# EAGLE design visp-i2c-mux-bmp388 (EAGLE 7.6.0)
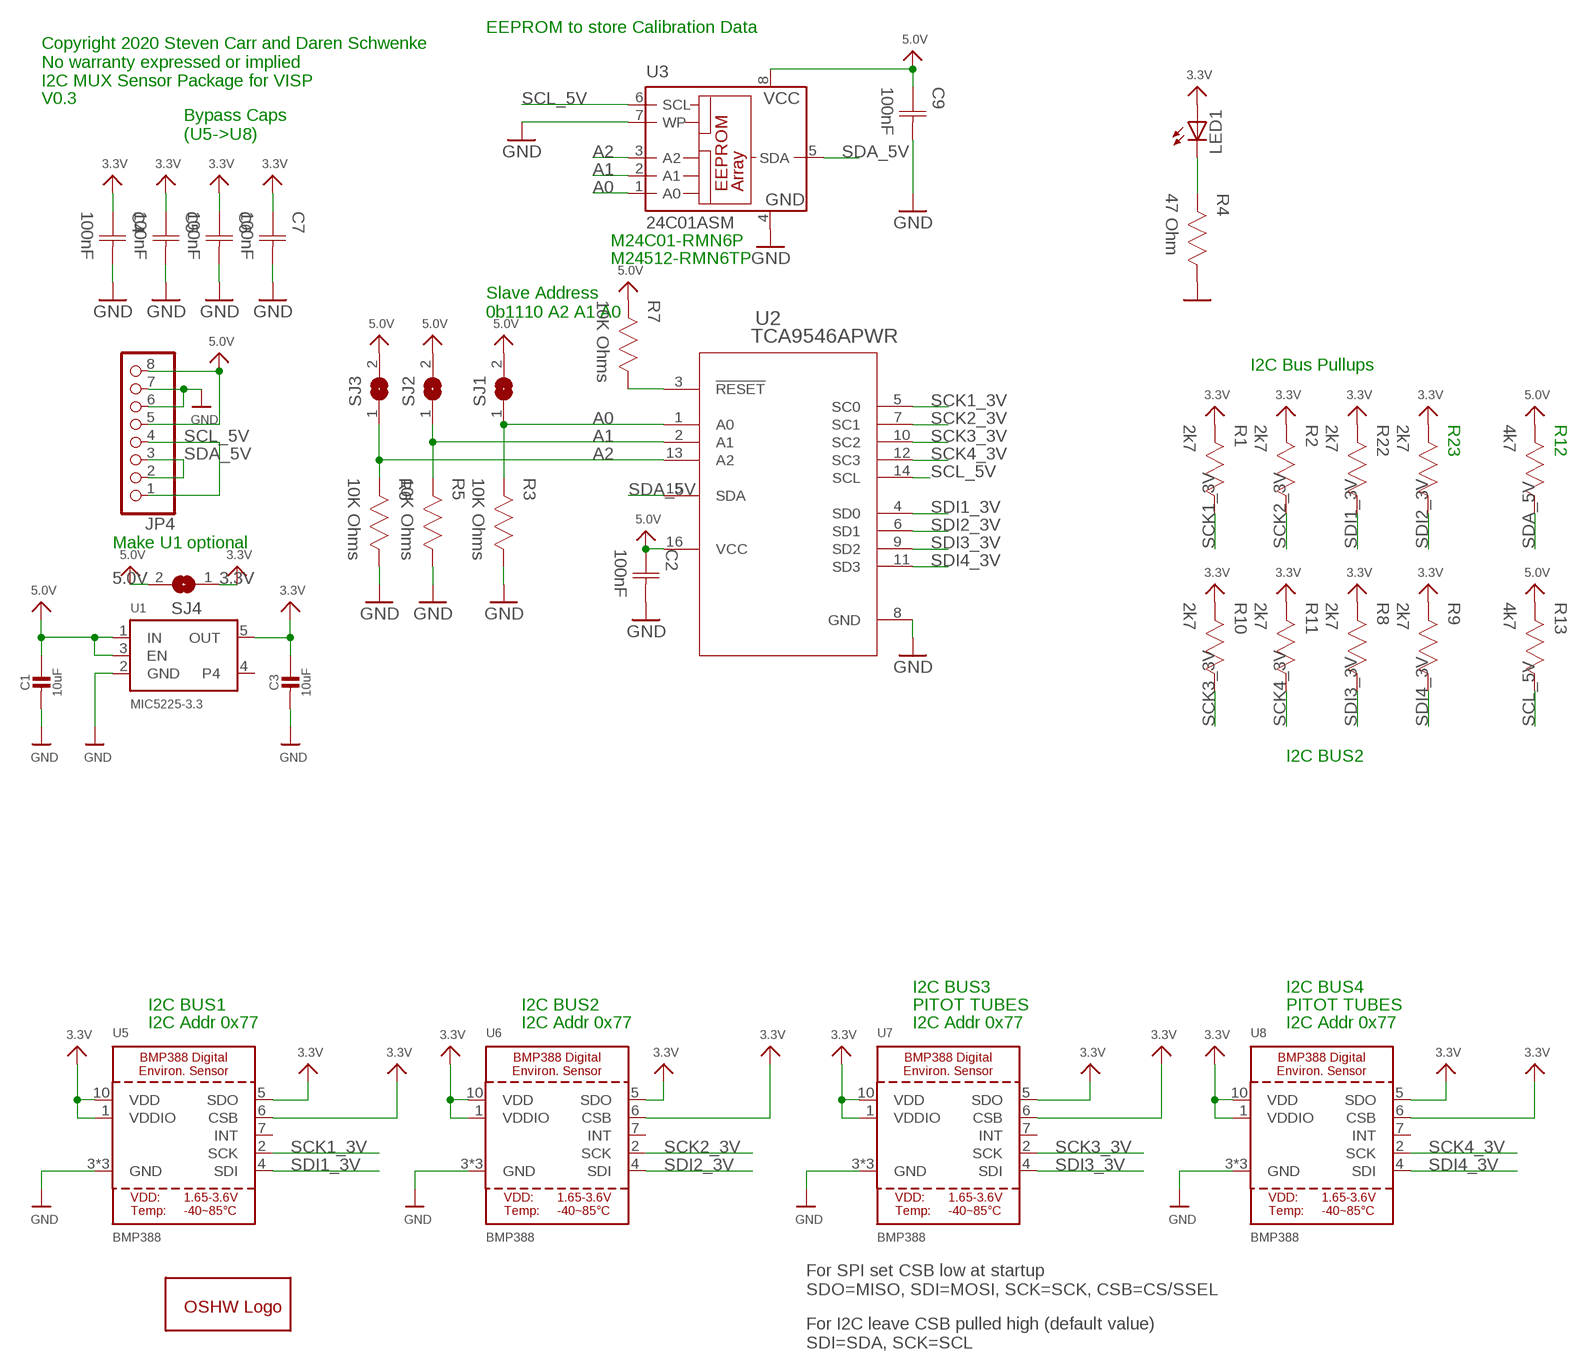
[diagram p0: schematic, sheet 1]

## Parts
C1  10uF  CAP_CERAMIC_0805  [_0805]
C2  100nF  CAPACITOR-0402  [CAP0402]
C3  10uF  CAP_CERAMIC_0805  [_0805]
C4  100nF  CAPACITOR-0402  [CAP0402]
C5  100nF  CAPACITOR-0402  [CAP0402]
C6  100nF  CAPACITOR-0402  [CAP0402]
C7  100nF  CAPACITOR-0402  [CAP0402]
C9  100nF  CAPACITOR-0402  [CAP0402]
GOLD_ORB_SM1  OSHWLOGOLOGO8MM  [OSHW_8MM]
JP4  PINHD-1X08_2.54  [1X08]
LED1  LEDCHIP-LED0603  [CHIP-LED0603]
R1  2k7  RESISTOR-0402  [RES0402]
R2  2k7  RESISTOR-0402  [RES0402]
R3  10K Ohms  RESISTOR-0402  [RES0402]
R4  47 Ohm  RESISTOR-0402  [RES0402]
R5  10K Ohms  RESISTOR-0402  [RES0402]
R6  10K Ohms  RESISTOR-0402  [RES0402]
R7  10K Ohms  RESISTOR-0402  [RES0402]
R8  2k7  RESISTOR-0402  [RES0402]
R9  2k7  RESISTOR-0402  [RES0402]
R10  2k7  RESISTOR-0402  [RES0402]
R11  2k7  RESISTOR-0402  [RES0402]
R12  4k7  RESISTOR-0402  [RES0402]
R13  4k7  RESISTOR-0402  [RES0402]
R22  2k7  RESISTOR-0402  [RES0402]
R23  2k7  RESISTOR-0402  [RES0402]
SJ1  SJ  [SJ]
SJ2  SJ  [SJ]
SJ3  SJ  [SJ]
SJ4  SJ  [SJ]
U1  MIC5225-3.3  VREG_SOT23-5  [SOT23-5]
U2  TCA9546APWR  [PW16]
U3  24C01ASM  [SO-08M]
U5  BMP388  [BMP388]
U6  BMP388  [BMP388]
U7  BMP388  [BMP388]
U8  BMP388  [BMP388]

## Nets
3.3V: C3.1 C4.1(C1) C5.1(C1) C6.1(C1) C7.1(C1) LED1.A R1.2 R2.2 R8.2 R9.2 R10.2 R11.2 R22.2 R23.2 SJ4.1 U1.5(OUT) U5.1(VDDIO) U5.5(SDO) U5.6(CSB) U5.10(VDD) U6.1(VDDIO) U6.5(SDO) U6.6(CSB) U6.10(VDD) U7.1(VDDIO) U7.5(SDO) U7.6(CSB) U7.10(VDD) U8.1(VDDIO) U8.5(SDO) U8.6(CSB) U8.10(VDD)
5.0V: C1.1 C2.1(C1) C9.1(C1) JP4.5 JP4.8 R7.2 R12.2 R13.2 SJ1.2 SJ2.2 SJ3.2 SJ4.2 U1.1(IN) U1.3(EN) U2.16(VCC) U3.8(VCC)
A0: R3.2 SJ1.1 U2.1(A0) U3.1(A0)
A1: R5.2 SJ2.1 U2.2(A1) U3.2(A1)
A2: R6.2 SJ3.1 U2.13(A2) U3.3(A2)
GND: C1.2 C2.2(C2) C3.2 C4.2(C2) C5.2(C2) C6.2(C2) C7.2(C2) C9.2(C2) JP4.6 JP4.7 R3.1 R4.1 R5.1 R6.1 U1.2(GND) U2.8(GND) U3.4(GND) U3.7(WP) U5.3(GND) U5.8(GND) U5.9(GND) U6.3(GND) U6.8(GND) U6.9(GND) U7.3(GND) U7.8(GND) U7.9(GND) U8.3(GND) U8.8(GND) U8.9(GND)
LED: LED1.C R4.2
RESET: R7.1 U2.3(!RESET)
SCK1_3V: R1.1 U2.5(SC0) U5.2(SCK)
SCK2_3V: R2.1 U2.7(SC1) U6.2(SCK)
SCK3_3V: R10.1 U2.10(SC2) U7.2(SCK)
SCK4_3V: R11.1 U2.12(SC3) U8.2(SCK)
SCL_5V: JP4.1 JP4.4 R13.1 U2.14(SCL) U3.6(SCL)
SDA_5V: JP4.2 JP4.3 R12.1 U2.15(SDA) U3.5(SDA)
SDI1_3V: R22.1 U2.4(SD0) U5.4(SDI)
SDI2_3V: R23.1 U2.6(SD1) U6.4(SDI)
SDI3_3V: R8.1 U2.9(SD2) U7.4(SDI)
SDI4_3V: R9.1 U2.11(SD3) U8.4(SDI)
Unconnected: U1.4 U5.7(INT) U6.7(INT) U7.7(INT) U8.7(INT)

## Notes on the sheet
- EEPROM to store Calibration Data
- Copyright 2020 Steven Carr and Daren Schwenke
  No warranty expressed or implied
  I2C MUX Sensor Package for VISP
- V0.3
- Bypass Caps
  (U5->U8)
- M24C01-RMN6P
- M24512-RMN6TP
- Slave Address
  0b1110 A2 A1 A0
- I2C Bus Pullups
- Make U1 optional
- I2C BUS2
- I2C BUS3 | I2C BUS4
- I2C BUS1 | I2C BUS2 | PITOT TUBES | PITOT TUBES
- I2C Addr 0x77 | I2C Addr 0x77 | I2C Addr 0x77 | I2C Addr 0x77
- For SPI set CSB low at startup
  SDO=MISO, SDI=MOSI, SCK=SCK, CSB=CS/SSEL
- For I2C leave CSB pulled high (default value)
  SDI=SDA, SCK=SCL

## Library data of the parts
C1 C3 = microbuilder:CAP_CERAMIC: Ceramic Capacitors For new designs, use the packages preceded by an '_' character since they are more reliable: The following footprints should be used on most boards: _0402 - Standard footprint for regular board layouts _0603 - Standard footprint for regular board layouts _0805 - Standard footprint for regular board layouts _1206 - Standard footprint for regular board layouts For extremely tight-pitch boards where space is at a premium, the following 'micro-pitch' footprints can be used (smaller pads, no silkscreen outline, etc.): _0402MP - Micro-pitch footprint for very dense/compact boards _0603MP - Micro-pitch footprint for very dense/compact boards _0805MP - Micro-pitch footprint for very dense/compact boards _1206MP - Micro-pitch footprint for very dense/compact boards; MPN: C1608X5R1A106M080AC
C2 C9 = Capacitor:CAPACITOR; MPN: CL10B104KB8NNNC
C4-C7 = Capacitor:CAPACITOR; MPN: CL10F104ZO8NNNC
GOLD_ORB_SM1 = oshw:OSHWLOGO: The OSHW logo for PCB layout
JP4 = pinhead-2:PINHD-1X08: PIN HEADER
LED1 = led:LED: LED OSRAM: - CHIPLED LG R971, LG N971, LY N971, LG Q971, LY Q971, LO R971, LY R971 LH N974, LH R974 LS Q976, LO Q976, LY Q976 LO Q996 - Hyper CHIPLED LW Q18S LB Q993, LB Q99A, LB R99A - SideLED LS A670, LO A670, LY A670, LG A670, LP A670 LB A673, LV A673, LT A673, LW A673 LH A674 LY A675 LS A676, LA A676, LO A676, LY A676, LW A676 LS A679, LY A679, LG A679 - Hyper Micro SIDELED® LS Y876, LA Y876, LO Y876, LY Y876 LT Y87S - SmartLED LW L88C, LW L88S LB L89C, LB L89S, LG L890 LS L89K, LO L89K, LY L89K LS L896, LA L896, LO L896, LY L896 - TOPLED LS T670, LO T670, LY T670, LG T670, LP T670 LSG T670, LSP T670, LSY T670, LOP T670, LYG T670 LG T671, LOG T671, LSG T671 LB T673, LV T673, LT T673, LW T673 LH T674 LS T676, LA T676, LO T676, LY T676, LB T676, LH T676, LSB T676, LW T676 LB T67C, LV T67C, LT T67C, LS T67K, LO T67K, LY T67K, LW E67C LS E67B, LA E67B, LO E67B, LY E67B, LB E67C, LV E67C, LT E67C LW T67C LS T679, LY T679, LG T679 LS T770, LO T770, LY T770, LG T770, LP T770 LB T773, LV T773, LT T773, LW T773 LH T774 LS E675, LA E675, LY E675, LS T675 LS T776, LA T776, LO T776, LY T776, LB T776 LHGB T686 LT T68C, LB T68C - Hyper Mini TOPLED® LB M676 - Mini TOPLED Santana® LG M470 LS M47K, LO M47K, LY M47K Source: http://www.osram.convergy.de LUXEON: - LUMILED® LXK2-PW12-R00, LXK2-PW12-S00, LXK2-PW14-U00, LXK2-PW14-V00 LXK2-PM12-R00, LXK2-PM12-S00, LXK2-PM14-U00 LXK2-PE12-Q00, LXK2-PE12-R00, LXK2-PE12-S00, LXK2-PE14-T00, LXK2-PE14-U00 LXK2-PB12-K00, LXK2-PB12-L00, LXK2-PB12-M00, LXK2-PB14-N00, LXK2-PB14-P00, LXK2-PB14-Q00 LXK2-PR12-L00, LXK2-PR12-M00, LXK2-PR14-Q00, LXK2-PR14-R00 LXK2-PD12-Q00, LXK2-PD12-R00, LXK2-PD12-S00 LXK2-PH12-R00, LXK2-PH12-S00 LXK2-PL12-P00, LXK2-PL12-Q00, LXK2-PL12-R00 Source: www.luxeon.com KINGBRIGHT: KA-3528ASYC Source: www.kingbright.com; MPN: SML-D12P8WT86
R1-R3 R5-R13 R22 R23 = Resistor:RESISTOR; MPN: CRCW060310K0FKEAC
R4 = Resistor:RESISTOR; MPN: RC0603FR-0747RL
SJ1-SJ4 = jumper:SJ: SMD solder JUMPER
U1 = microbuilder:VREG_SOT23-5: SOT23-5 Fixed Voltage Regulators Part Current Out V Out V In V Dropout θJA (°C/W) TJ (°C) Digikey Part No. ADP121 150mA 3.3V 3.4-5.5V 0.09V @ 150mA -- -- ADP121-AUJZ33R7CT-ND ADP121 150mA 3.0V 3.1-5.5V 0.09V @ 150mA -- -- ADP121-AUJZ30R7CT-ND ADP122 300mA 3.3V 3.4-5.5V 0.085V @ 300mA -- -- ADP122AUJZ-3.3-R7CT-ND ADP1712 300mA 3.3V 3.5-5.5V 0.17V @ 300mA -- -- ADP1712AUJZ-3.3-R7TR-ND AP7311 (Low Cost) 150mA 3.3V 3.5-6V 0.15V @ 150mA -- -- AP7311-33WG-7DICT-ND LD39015M18R 150mA 1.8V 1.9V-5.5V 0.08V @ 100mA -- -- 497-6977-1-ND LP2985A-33DBVR 150mA 3.3V 3.3-16V 0.28V @ 150mA 206 150 296-18479-1-ND MCP1824T-3302E/OT 300mA 3.3V 3.5V-6V 0.2V @ 300mA -- -- MCP1824T-3302E/OTCT-ND MIC5205-2.5YM5 TR 150mA 2.5V 2.7-16V 0.165V @ 150mA -- -- 576-1257-2-ND MIC5205-3.0YM5 TR 150mA 3.0V 3.2V-16V 0.165V @ 150mA -- -- 576-1258-2-ND MIC5205-3.3YM5 TR 150mA 3.3V 3.5V-16V 0.165V @ 150mA -- -- 576-1259-2-ND TPS780330220 150mA 3.3V+2.2V 3.6-5.5V 250mV Max -- -- 296-23332-1-ND TDA3663/N1,135 100mA 3.3V 3.5-45V 0.18V @ 50mA -- -- 568-5343-1-ND Max operating temp can be calculated using θJA, TJ (max junction temperature), and power in watts. Set the "Maximum Ambient Temperature" until it reaches TJ ("Max Junction Temperature"), which is the absolute limit for safe use of the regulator: Heat Sink Temperature Calculator <http://www.daycounter.com/Calculators/Heat-Sink-Temperature-Calculator.phtml> For example, With 12V source into a 3.3V LP2985 and a 30mA load, we are dissipating (12V-3.3V) * 0.03A = 0.261W. With a θJA of 206 °C/W, a TJ of 150°C, and 261mW we can safely use the chip without a heat sink up to 75°C (=147.1°C Junction Temperature).; MPN: MIC5225-3.3YM5-TR
U2 = TCA9546A:TCA9546APWR; BUILT_BY: EMA_UL_Team; MANUFACTURER_PART_NUMBER: TCA9546APWR; VENDOR: Texas Instruments
U3 = microchip:24*: Serial EEPROM I2C; MF: MICROCHIP; MPN: M24C01-RMN6P
U5-U8 = microbuilder:BMP388; MPN: BMP388

## Board
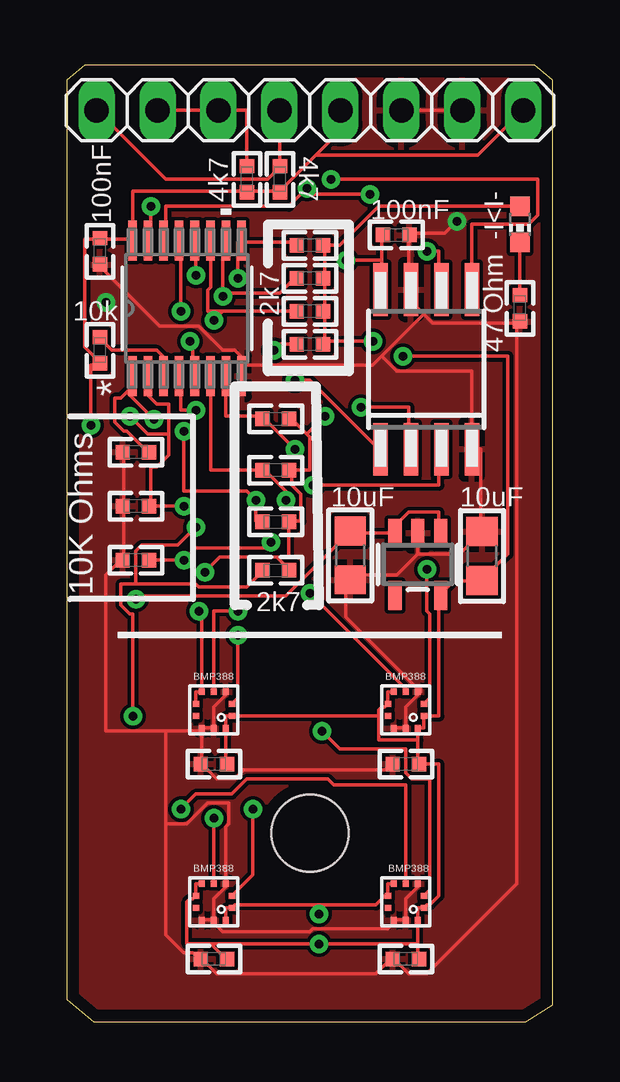
[diagram p1: board, top side]
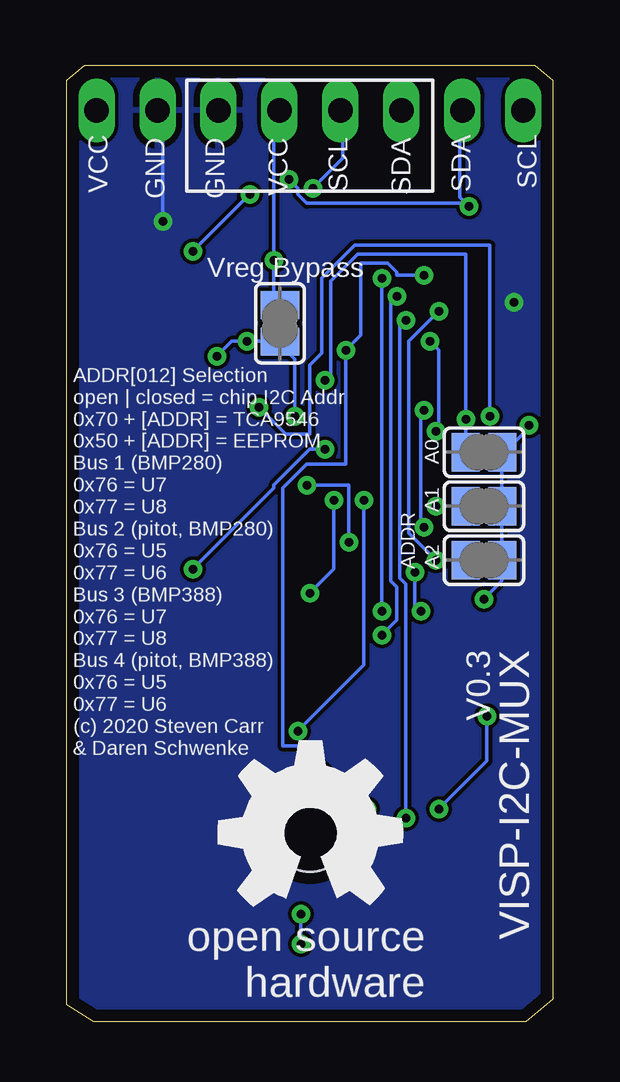
[diagram p2: board, bottom side, seen from below]

Size 20.25 x 39.88 mm. Coordinates in mm from the lower left corner, seen from the top.
Outline: 0.75,39.88 0,39.25 0,0.95 1.12,0 19.12,0 20.25,0.72 20.25,39.25 19.5,39.88 0.75,39.88
Copper layers (1*16): Top 0.0178mm / dielectric 59mil / Bottom 0.0178mm
Design rules "SSC-EAGLE-2Lyr_v1.0.0.3 *": minimum track width 6mil, minimum drill 14mil, track to track 6mil, track to pad 6mil, pad to pad 6mil, via to via 6mil, smd to smd 6mil, copper to edge 20mil, drill to drill 16mil, minimum pad ring 8mil, minimum via ring 8mil, stop-mask expansion 3mil, vias tented up to drill 0mil, thermal gap 10mil
Holes 3.2 mm at 10.12,7.88
vRestrict: area 4.6,2.5 to 7.6,5.5; area 12.6,2.5 to 15.6,5.5; area 4.6,10.5 to 7.6,13.5; area 12.6,10.5 to 15.6,13.5

### Footprints (pad centres in the part's own frame; a part is rotated, then mirrored left to right if it is on the bottom)
_0805 = smd 1.2 x 1.3: 1 -1.016,0; 2 1.016,0
CAP0402 = smd 0.6 x 0.6: 1 -0.55,0; 2 0.55,0
1X08 = drill 1.016 long: 1 -8.89,0; 2 -6.35,0; 3 -3.81,0; 4 -1.27,0; 5 1.27,0; 6 3.81,0; 7 6.35,0; 8 8.89,0
CHIP-LED0603 = smd 0.8 x 0.8: A 0,-0.75; C 0,0.75
RES0402 = smd 0.6 x 0.6: 1 -0.55,0; 2 0.55,0
SJ = smd 1.168 x 1.6: 1 -0.762,0; 2 0.762,0
SOT23-5 = smd 0.55 x 1.2: 1 -0.95,-1.3; 2 0,-1.3; 3 0.95,-1.3; 4 0.95,1.3; 5 -0.95,1.3
PW16 = smd 1.676 x 0.356: 1 -2.819,2.275; 2 -2.819,1.625; 3 -2.819,0.975; 4 -2.819,0.325; 5 -2.819,-0.325; 6 -2.819,-0.975; 7 -2.819,-1.625; 8 -2.819,-2.275; 9 2.819,-2.275; 10 2.819,-1.625; 11 2.819,-0.975; 12 2.819,-0.325; 13 2.819,0.325; 14 2.819,0.975; 15 2.819,1.625; 16 2.819,2.275
SO-08M = smd 0.6 x 2.2: 1 -1.905,-3.33; 2 -0.635,-3.33; 3 0.635,-3.33; 4 1.905,-3.33; 5 1.905,3.33; 6 0.635,3.33; 7 -0.635,3.33; 8 -1.905,3.33
BMP388 = smd 0.25 x 0.275: 1 0.25,0.75; 2 -0.25,0.75; 6 -0.25,-0.75; 7 0.25,-0.75 | smd 0.275 x 0.25: 3 -0.762,0.5; 4 -0.762,0; 5 -0.762,-0.5; 8 0.762,-0.5; 9 0.762,0; 10 0.762,0.5

### Placement (x,y rotation side)
C1  11.8,19.45 270 top
C2  1.38,32.12 270 top
C3  17.3,19.43 90 top
C4  6.12,10.75 180 top
C5  14.12,2.62 180 top
C6  6.12,2.62 180 top
C7  14.12,10.75 180 top
C9  13.72,32.8 0 top
GOLD_ORB_SM1  10.12,7.88 0 bottom
JP4  10.12,38 0 top
LED1  18.88,33.25 180 top
R1  8.71,20.84 0 top
R2  8.71,25.14 0 top
R3  2.88,23.75 0 top
R4  18.88,29.75 90 top
R5  2.88,21.5 0 top
R6  2.88,19.25 0 top
R7  1.38,28 270 top
R8  10.12,32.38 0 top
R9  10.12,29.62 0 top
R10  10.12,31 0 top
R11  10.12,28.25 0 top
R12  7.5,35.12 270 top
R13  8.88,35.12 270 top
R22  8.71,18.83 0 top
R23  8.71,23 0 top
SJ1  2.88,23.75 0 bottom
SJ2  2.88,21.5 0 bottom
SJ3  2.88,19.25 0 bottom
SJ4  11.38,29.12 90 bottom
U1  14.62,19.07 180 top
U2  5,29.75 90 top
U3  14.97,27.2 0 top
U5  14.12,5 270 top
U6  14.12,13 270 top
U7  6.12,13 270 top
U8  6.12,5 270 top

### Tracks (layer width: path | path; a pad name or v marks a point on that pad's centre or on a via)
3.3V  (via drill 0.36)
  Top 0.152: U8.10 6.62,4.75 U8.1 7,4.88 10.5,4.88 | U5.5 13.38,5.75 U5.6 13.25,5.25 12.88,4.88 10.5,4.88 | 14.62,3.25 14.62,2.62 C5.1 | 14.62,3.25 U5.10 14.62,4.75 U5.1 15,4.88 15.12,4.88 15.5,5.25 15.5,10.75 C7.1 14.62,10.75 14.62,11.75 | U8.5 5.38,5.75 U8.6 5.25,5.12 5.12,5.12 5,5 5,3.25 6,3.25 | 6,3.25 6.62,2.62 C6.1 | 6,3.25 v10.5,3.25 14.62,3.25 | v10.5,4.5 10.5,4.88 | C4.1 6.62,10.75 U7.10 6.62,12.75 U7.1 13,12.75 | U6.5 13.38,13.75 U6.6 13.25,13.12 13.12,13.12 13,13 13,12.75 | 14.62,11.75 U6.10 14.88,12.25 U6.1 15.5,12.75 15.5,17.75 U1.5 15.62,17.88 16.12,18.38 17.25,18.38 C3.1 17.38,18.5 18.38,19.5 18.38,27.75 v14,27.75 | 13,12.75 13,11.75 14.62,11.75 | 10.75,29.62 10.75,28.38 | 10.75,28.38 10.75,28.25 R11.2 10.75,28.38 | 10.75,32.38 10.75,31 | LED1.A 13,34 11.38,32.38 10.75,32.38 | 10.75,32.38 R8.2 | 10.75,31 10.75,29.62 | 10.75,29.62 R9.2 | 10.75,31 R10.2 | 10.75,28.38 v12.75,28.38 | U7.6 5.38,13.75 U7.5 5.62,17.12 v5.5,17.12 | v5.75,18.75 6.38,19.38 8.75,19.38 | 8.75,19.38 9.25,18.88 R22.2 | 8.75,19.38 9.25,19.38 9.25,20.75 R1.2 9.38,20.88 9.75,20.88 9.75,22 9.38,22.38 9.38,23 | 10,24.5 10.12,24.38 10.12,23 9.38,23 | 10,24.5 9.38,25.12 R2.2 | 9.38,23 R23.2 | 10,24.5 v10.75,25.25
  Bottom 0.152: v10.5,3.25 v10.5,4.5 | v5.5,17.12 5.75,17.38 v5.75,18.75 | v10.75,25.25 10.75,27.62 11.38,28.25 SJ4.1 11.38,28.38 v12.75,28.38 13.38,28.38 v14,27.75
5.0V  (via drill 0.36)
  Top 0.152: 13.38,20.38 11.88,20.38 C1.1 11.75,20.38 9.12,17.75 3,17.75 v2.88,17.62 | 13.38,20.38 13.62,20.38 U1.3 | 13.38,20.38 14.25,21.25 15.5,21.25 15.5,20.5 U1.1 | 1.38,32.62 0.75,32.62 0.75,28.12 1.38,27.5 R7.2 1.38,27.38 1,27.38 v1,24.88 | 1.38,32.62 2.62,32.62 U2.16 2.75,32.62 2.75,34.62 7.5,34.62 | 1.38,32.62 C2.1 | 13.12,31.75 13.12,30.62 U3.8 | 13.12,31.75 13.12,32.75 C9.1 | 8.88,34.62 7.5,34.62 | 10.38,36.12 11.38,37.12 11.38,38 JP4.5 | 10.38,36.12 8.88,34.62 | 8.88,34.62 R13.2 | v11.62,31.75 13.12,31.75 | 10.38,36.12 17.12,36.12 19,38 JP4.8 | 7.5,34.62 R12.2
  Bottom 0.152: SJ2.2 SJ3.2 | SJ2.2 SJ1.2 2,23.75 1,24.75 v1,24.88 | SJ2.2 | v2.88,17.62 2.12,18.38 SJ3.2 | SJ3.2 | SJ4.2 11.38,30 11.62,30.25 v11.62,31.75 11.62,37.88 11.5,38 JP4.5
A0  (via drill 0.36)
  Top 0.152: 2.5,26.25 2.62,26.38 2.62,26.88 U2.1 | 2.5,26.25 2.25,26 2,26 2,25 2.38,24.62 2.5,24.62 3.38,23.75 R3.2 | 2.5,26.25 v3.62,25.12 | v9.5,26.75 10.12,26.75 13,23.88 U3.1
  Bottom 0.152: SJ1.1 v3.62,25.12 3.62,32 8.12,32 9.25,30.88 9.25,27 v9.5,26.75
A1  (via drill 0.36)
  Top 0.152: 3.5,21.5 3.5,23.12 3.75,23.12 4.25,23.62 4.25,24.5 | 4.25,24.5 4.25,25.75 3.75,25.75 3.38,26.12 U2.2 | 3.5,21.5 v4.88,21.5 | 3.5,21.5 R5.2 | v12.25,25.62 14.25,25.62 14.25,23.88 U3.2 | v2.62,25.25 3.38,24.5 4.25,24.5
  Bottom 0.152: v4.88,21.5 SJ2.1 | v12.25,25.62 11.12,24.5 10.12,24.5 10.12,27.38 9.62,27.88 9.62,31 8.25,32.38 2.62,32.38 v2.62,25.25
A2  (via drill 0.36)
  Top 0.152: R6.2 v4.88,19.25 5.38,19.75 8.25,19.75 v8.5,20 | v4.75,29.62 4.75,32.5 U2.13 | v10.25,22.38 15.5,22.38 15.5,23.88 U3.3
  Bottom 0.152: SJ3.1 v4.88,19.25 6,20.38 6,28.38 v4.75,29.62 | v10.25,22.38 8.5,22.38 v8.5,20
GND  (via drill 0.36)
  Top 0.152: U8.9 U8.8 | U8.9 6.12,5.12 6.62,5.62 U8.3 6.62,8.12 6.75,8.25 6.75,9.12 5.88,9.12 5,8.25 4.12,8.25 | U8.9 6.12,4.12 6.5,3.75 10.12,3.75 10.25,3.88 13.38,3.88 13.62,4.12 U5.8 U5.9 | U5.3 14.62,5.62 14.12,5.12 U5.9 | U5.9 | 2.38,21.5 2.38,19.25 R6.1 2.25,19.25 1.62,18.62 1.62,12.12 4.12,12.12 | 2.38,21.5 2.38,23.75 R3.1 | 2.38,21.5 R5.1 | U7.9 U7.8 5.62,12.12 | U7.3 6.62,13.62 6.12,13.12 U7.9 | U7.9 | 5.62,12.12 5.62,10.75 | 5.62,10.75 6.25,10.12 7,10.12 7.38,10.5 13.25,10.5 13.5,10.75 C7.2 | 5.62,10.75 C4.2 | 5.62,12.12 4.12,12.12 | 4.12,12.12 4.12,8.25 | 4.12,8.25 4.12,3.62 4.88,2.88 5.25,2.88 5.5,2.62 C6.2 5.62,2.62 6.25,2 12.88,2 13.5,2.62 C5.2 13.62,2.62 14.25,2 15,2 18.75,5.75 18.75,29.12 | 14.62,19.5 U1.2 | 14.62,19.5 16.38,19.5 17.25,20.38 C3.2 17.25,20.5 17.25,23.88 U3.4 16.88,27.12 13.75,27.12 13.12,27.75 | U6.9 U6.8 | 14.62,13.88 11.62,16.88 11.62,18.38 11.75,18.38 C1.2 11.88,18.5 12,18.62 13.75,18.62 14.62,19.5 | U6.9 14.12,13.12 14.75,13.75 14.75,13.88 14.62,13.88 | U6.9 | 14.62,13.88 U6.3 | JP4.7 JP4.6 | 18.75,29.12 15.25,29.12 14.88,29.5 | 18.75,29.12 18.88,29.12 R4.1 18.75,29.12 | 14.88,29.5 14.38,30 14.38,30.5 U3.7 14.25,30.62 14.25,32.75 C9.2 14.38,32.88 15.75,32.88 v16.25,33.38 | 7.25,27.38 7.25,27 U2.8 7.25,27.38 | 7.25,27.38 7.25,27.75 7,28 6.5,28 5.5,29 3.88,29 1.38,31.5 C2.2 | 13.12,27.75 12.75,27.38 7.25,27.38 | 13.12,27.75 14.88,29.5
  Bottom 0.152: v16.25,33.38 16.25,37.88 16.38,38 JP4.7
  other vias: 1.62,30
  pour Top: 0.12,38.88 1,39.75 19.12,39.75 20.12,38.75 20.12,0.62 19.38,-0.12 1,-0.12 0.12,0.75
  pour Bottom: 0.12,38.88 1,39.75 19.12,39.75 20.12,38.75 20.12,0.62 19.38,-0.12 1,-0.12 0.12,0.75
LED
  Top 0.152: LED1.C R4.2
RESET
  Top 0.152: R7.1 1.38,28.5 1.88,28 3.75,28 4,27.75 4,27 U2.3
SCK1_3V  (via drill 0.36)
  Top 0.152: U5.2 15.12,5.5 15.12,10.12 14.38,10.12 14.12,10.38 14.12,11.38 11.38,11.38 v10.62,12.12 | R1.1 8.12,20.88 7.88,20.88 v7.88,21.75 7.5,22.12 4.88,22.12 v4.88,24.62 | v5.12,28.38 5.25,28.38 5.25,27 U2.5
  Bottom 0.152: v10.62,12.12 7.88,14.88 v7.88,21.75 | v5.12,28.38 4.75,28 4.75,24.88 4.88,24.75 v4.88,24.62
SCK2_3V  (via drill 0.36)
  Top 0.152: U6.2 15.12,13.5 15.12,17 15,17.12 v15,18.88 | v9.5,23.88 8.25,25.12 R2.1 8.12,25.25 6.62,25.25 6.62,26.88 U2.7
  Bottom 0.152: v15,18.88 11.62,22.25 11.62,22.38 10.12,23.88 v9.5,23.88
SCK3_3V  (via drill 0.36)
  Top 0.152: U7.2 7.12,13.5 v7.12,16.12 | 6.5,30.38 6.5,32.5 6.62,32.5 U2.10 | 6.5,30.38 8.88,30.38 9.5,31 R10.1 | 6.5,30.38 v6.5,30.25
  Bottom 0.152: v7.12,16.12 6.5,16.75 6.5,18.12 6.75,18.38 6.75,30 v6.5,30.25
SCK4_3V  (via drill 0.36)
  Top 0.152: U8.2 7.75,6.12 v7.75,8.88 | v8.62,28 8.88,28.25 R11.1 | v5.38,31.12 5.38,32.5 U2.12
  Bottom 0.152: v7.75,8.88 10.38,11.5 11.25,11.5 11.25,22.25 10.25,23.25 8.62,23.25 v8.62,28 8,28.62 8,31.62 6.88,31.62 6.5,31.25 6.5,31.12 v5.38,31.12
SCL_5V  (via drill 0.36)
  Top 0.152: JP4.4 8.88,38 R13.1 8.88,35.62 8.38,35.12 4.12,35.12 1.25,38 JP4.1 | 9.75,34.5 9.25,34 4.12,34 4.12,32.62 U2.14 | v15,32.12 15.5,32.12 15.5,30.62 U3.6 | 9.75,34.5 v12.62,34.5 | 9.75,34.5 v10,34.75
  Bottom 0.152: v10,34.75 8.75,36 8.75,38 JP4.4 | v12.62,34.5 v15,32.12
SDA_5V  (via drill 0.36)
  Top 0.152: R12.1 7.5,38 JP4.3 JP4.2 | v3.5,34 3.5,32.62 U2.15 | U3.5 16.88,33.25 19.25,33.25 19.62,33.62 19.62,35.12 v11,35.12
  Bottom 0.152: 3.62,34.12 3.88,34.38 3.88,38 JP4.2 | v11,35.12 10.62,34.75 10.62,34.5 10.25,34.12 3.62,34.12 | 3.62,34.12 v3.5,34
SDI1_3V  (via drill 0.36)
  Top 0.152: U5.4 14.12,9.88 11.12,9.88 10.88,10.12 7.5,10.12 6.88,9.5 5.38,9.5 v4.75,8.88 | v2.75,12.75 2.75,17 2.62,17 2.25,17.38 2.25,18.25 2.88,18.25 | 2.88,18.25 5.38,18.25 5.5,18.12 7.5,18.12 8.12,18.75 R22.1 | v5.38,25.5 4.75,25.5 4.75,26.88 U2.4 | v5.38,20.62 4.62,19.88 3.12,19.88 2.88,19.62 2.88,18.25
  Bottom 0.152: v4.75,8.88 2.75,10.88 v2.75,12.75 | v5.38,25.5 5.5,25.38 5.5,20.75 v5.38,20.62
SDI2_3V  (via drill 0.36)
  Top 0.152: v10.12,17.88 14.12,13.88 U6.4 | v9.12,21.75 9.12,22.12 8.25,23 R23.1 6,23 6,26.88 U2.6
  Bottom 0.152: v10.12,17.88 9.12,18.88 v9.12,21.75
SDI3_3V  (via drill 0.36)
  Top 0.152: U7.4 6.12,17.12 v7.12,17.12 | v7.12,31 7.12,32.5 7.25,32.5 U2.9 7.38,32.5 9.38,32.5 9.5,32.38 R8.1
  Bottom 0.152: v7.12,31 v7.12,17.12
SDI4_3V  (via drill 0.36)
  Top 0.152: v6.12,8.5 U8.4 | 6.5,29.62 v6.12,29.25 | R9.1 6.5,29.62 | 6.5,29.62 5.88,29.62 5.88,30.5 6,30.62 6,32.5 U2.11
  Bottom 0.152: v6.12,8.5 6.12,18.25 6.38,18.5 6.38,29 v6.12,29.25

### Text on the board
tNames: -I<I- | 10k | 10uF | 10uF | 2k7 | BMP388 | BMP388 | BMP388 | BMP388
bNames: SCL | SDA | SDA | SCL | VCC | GND | GND | VCC | Vreg Bypass | A0 | A1 | A2 | ADDR | VISP-I2C-MUX | V0.3 | ADDR[012] Selection / open | closed = chip I2C Addr / 0x70 + [ADDR] = TCA9546 / 0x50 + [ADDR] = EEPROM / Bus 1 (BMP280) / 0x76 = U7 / 0x77 = U8 / Bus 2 (pitot, BMP280) / 0x76 = U5 / 0x77 = U6 / Bus 3 (BMP388) / 0x76 = U7 / 0x77 = U8 / Bus 4 (pitot, BMP388) / 0x76 = U5 / 0x77 = U6 / (c) 2020 Steven Carr / & Daren Schwenke
tValues: *